# EAGLE design Mega Breakout (EAGLE 9.6.2)
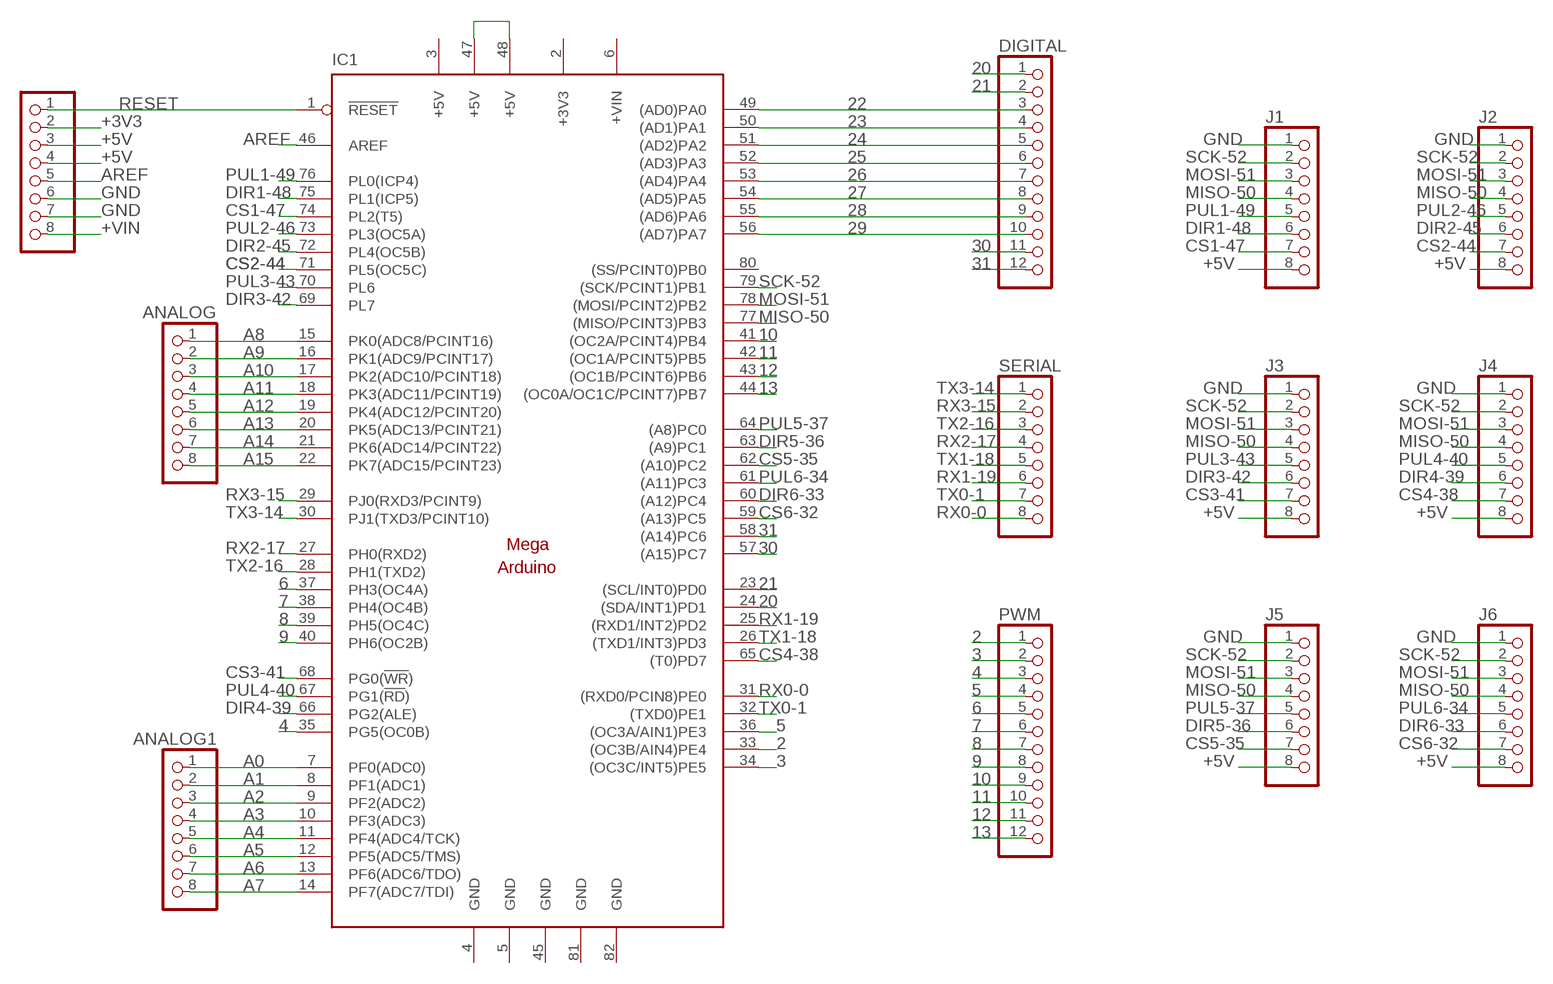
[diagram p0: schematic, sheet 1]

## Parts
ANALOG  PINHD-1X8  [1X08]
ANALOG1  PINHD-1X8  [1X08]
DIGITAL  PINHD-1X12  [1X12]
IC1  MEGAARDUINO_1  [MEGA_ARDUINO]
J1  PINHD-1X8  [1X08]
J2  PINHD-1X8  [1X08]
J3  PINHD-1X8  [1X08]
J4  PINHD-1X8  [1X08]
J5  PINHD-1X8  [1X08]
J6  PINHD-1X8  [1X08]
POWER  PINHD-1X8  [1X08]
PWM  PINHD-1X12  [1X12]
SERIAL  PINHD-1X8  [1X08]

## Nets
2: IC1.33((OC3B/AIN4)PE4) PWM.1
3: IC1.34((OC3C/INT5)PE5) PWM.2
4: IC1.35(PG5(OC0B)) PWM.3
5: IC1.36((OC3A/AIN1)PE3) PWM.4
6: IC1.37(PH3(OC4A)) PWM.5
7: IC1.38(PH4(OC4B)) PWM.6
8: IC1.39(PH5(OC4C)) PWM.7
9: IC1.40(PH6(OC2B)) PWM.8
10: IC1.41((OC2A/PCINT4)PB4) PWM.9
11: IC1.42((OC1A/PCINT5)PB5) PWM.10
12: IC1.43((OC1B/PCINT6)PB6) PWM.11
13: IC1.44((OC0A/OC1C/PCINT7)PB7) PWM.12
20: DIGITAL.1 IC1.24((SDA/INT1)PD1)
21: DIGITAL.2 IC1.23((SCL/INT0)PD0)
22: DIGITAL.3 IC1.49((AD0)PA0)
23: DIGITAL.4 IC1.50((AD1)PA1)
24: DIGITAL.5 IC1.51((AD2)PA2)
25: DIGITAL.6 IC1.52((AD3)PA3)
26: DIGITAL.7 IC1.53((AD4)PA4)
27: DIGITAL.8 IC1.54((AD5)PA5)
28: DIGITAL.9 IC1.55((AD6)PA6)
29: DIGITAL.10 IC1.56((AD7)PA7)
30: DIGITAL.11 IC1.57((A15)PC7)
31: DIGITAL.12 IC1.58((A14)PC6)
+3V3: POWER.2
+5V: J1.8 J2.8 J3.8 J4.8 J5.8 J6.8 POWER.3 POWER.4
+VIN: POWER.8
A0: ANALOG1.1 IC1.7(PF0(ADC0))
A1: ANALOG1.2 IC1.8(PF1(ADC1))
A2: ANALOG1.3 IC1.9(PF2(ADC2))
A3: ANALOG1.4 IC1.10(PF3(ADC3))
A4: ANALOG1.5 IC1.11(PF4(ADC4/TCK))
A5: ANALOG1.6 IC1.12(PF5(ADC5/TMS))
A6: ANALOG1.7 IC1.13(PF6(ADC6/TDO))
A7: ANALOG1.8 IC1.14(PF7(ADC7/TDI))
A8: ANALOG.1 IC1.15(PK0(ADC8/PCINT16))
A9: ANALOG.2 IC1.16(PK1(ADC9/PCINT17))
A10: ANALOG.3 IC1.17(PK2(ADC10/PCINT18))
A11: ANALOG.4 IC1.18(PK3(ADC11/PCINT19))
A12: ANALOG.5 IC1.19(PK4(ADC12/PCINT20))
A13: ANALOG.6 IC1.20(PK5(ADC13/PCINT21))
A14: ANALOG.7 IC1.21(PK6(ADC14/PCINT22))
A15: ANALOG.8 IC1.22(PK7(ADC15/PCINT23))
AREF: IC1.46(AREF) POWER.5
CS1-47: IC1.74(PL2(T5)) J1.7
CS2-44: IC1.71(PL5(OC5C)) J2.7
CS3-41: IC1.68(PG0(!WR!)) J3.7
CS4-38: IC1.65((T0)PD7) J4.7
CS5-35: IC1.62((A10)PC2) J5.7
CS6-32: IC1.59((A13)PC5) J6.7
DIR1-48: IC1.75(PL1(ICP5)) J1.6
DIR2-45: IC1.72(PL4(OC5B)) J2.6
DIR3-42: IC1.69(PL7) J3.6
DIR4-39: IC1.66(PG2(ALE)) J4.6
DIR5-36: IC1.63((A9)PC1) J5.6
DIR6-33: IC1.60((A12)PC4) J6.6
GND: J1.1 J2.1 J3.1 J4.1 J5.1 J6.1 POWER.6 POWER.7
MISO-50: IC1.77((MISO/PCINT3)PB3) J1.4 J2.4 J3.4 J4.4 J5.4 J6.4
MOSI-51: IC1.78((MOSI/PCINT2)PB2) J1.3 J2.3 J3.3 J4.3 J5.3 J6.3
N$1: IC1.47(+5V) IC1.48(+5V)
PUL1-49: IC1.76(PL0(ICP4)) J1.5
PUL2-46: IC1.73(PL3(OC5A)) J2.5
PUL3-43: IC1.70(PL6) J3.5
PUL4-40: IC1.67(PG1(!RD!)) J4.5
PUL5-37: IC1.64((A8)PC0) J5.5
PUL6-34: IC1.61((A11)PC3) J6.5
RESET: IC1.1(!RESET) POWER.1
RX0-0: IC1.31((RXD0/PCIN8)PE0) SERIAL.8
RX1-19: IC1.25((RXD1/INT2)PD2) SERIAL.6
RX2-17: IC1.27(PH0(RXD2)) SERIAL.4
RX3-15: IC1.29(PJ0(RXD3/PCINT9)) SERIAL.2
SCK-52: IC1.79((SCK/PCINT1)PB1) J1.2 J2.2 J3.2 J4.2 J5.2 J6.2
TX0-1: IC1.32((TXD0)PE1) SERIAL.7
TX1-18: IC1.26((TXD1/INT3)PD3) SERIAL.5
TX2-16: IC1.28(PH1(TXD2)) SERIAL.3
TX3-14: IC1.30(PJ1(TXD3/PCINT10)) SERIAL.1
Unconnected: IC1.80((SS/PCINT0)PB0)

## Power pins joined to a net without a drawn wire
+3V3: IC1.2(+3V3)
+5V: IC1.3(+5V)
+VIN: IC1.6(+VIN)
GND: IC1.4(GND) IC1.5(GND) IC1.45(GND) IC1.81(GND) IC1.82(GND)

## Library data of the parts
ANALOG ANALOG1 J1-J6 POWER SERIAL = pinhead:PINHD-1X8: PIN HEADER
DIGITAL PWM = pinhead:PINHD-1X12: PIN HEADER
IC1 = arduino:MEGAARDUINO_1: The Arduino Mega is a microcontroller board based on the ATmega1280. - 54 digital input/output pins (of which 14 can be used as PWM outputs) - 16 analog inputs - 4 UARTs (hardware serial ports) - 16 MHz crystal oscillator - USB connection - power jack - ICSP header - reset button It contains everything needed to support the microcontroller; simply connect it to a computer with a USB cable or power it with a AC-to-DC adapter or battery to get started. The Mega is compatible with most shields designed for the Arduino Duemilanove or Diecimila. http://arduino.cc/en/Main/ArduinoBoardMega

## Board
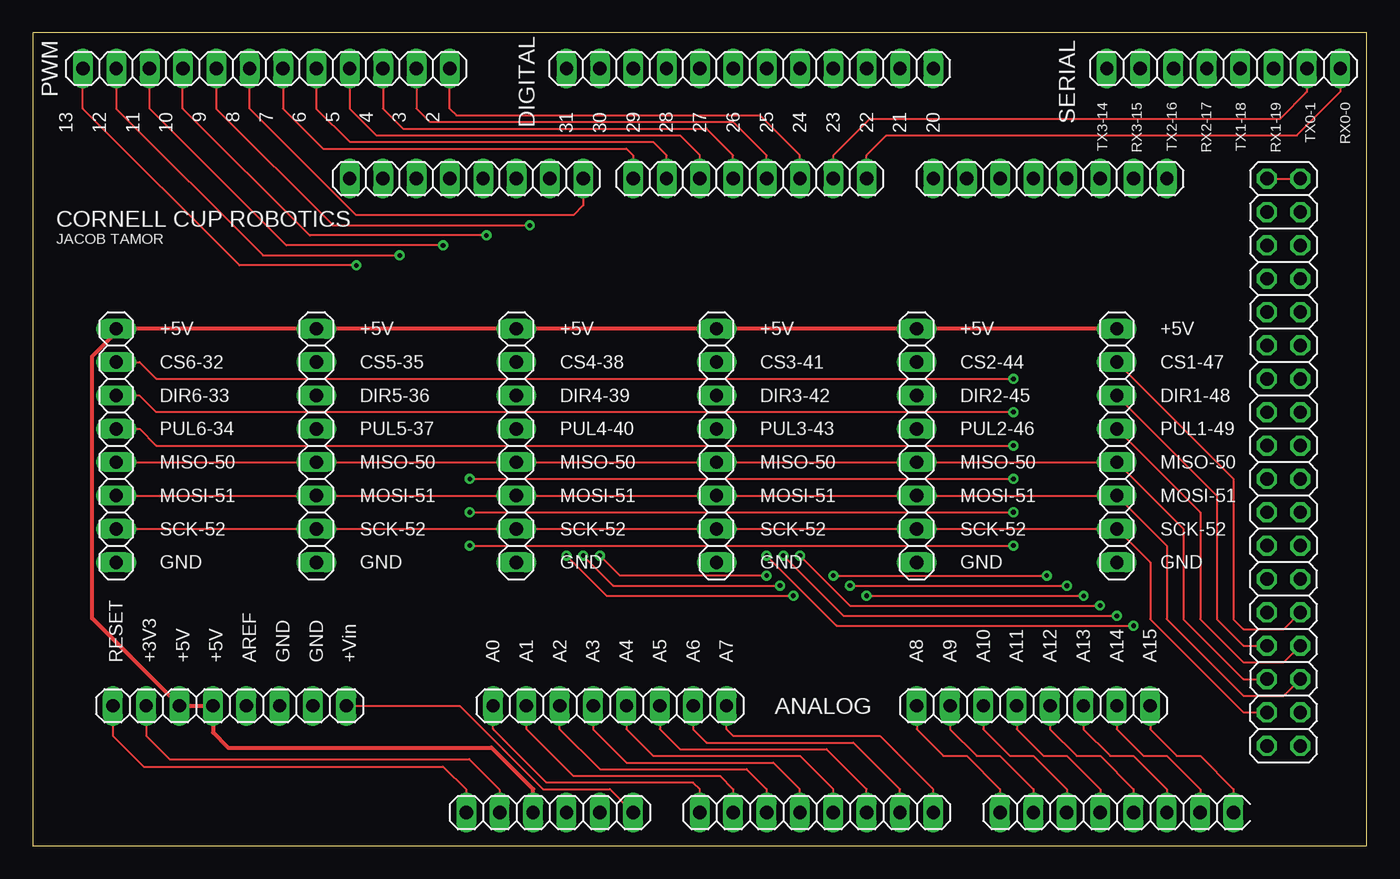
[diagram p1: board, top side]
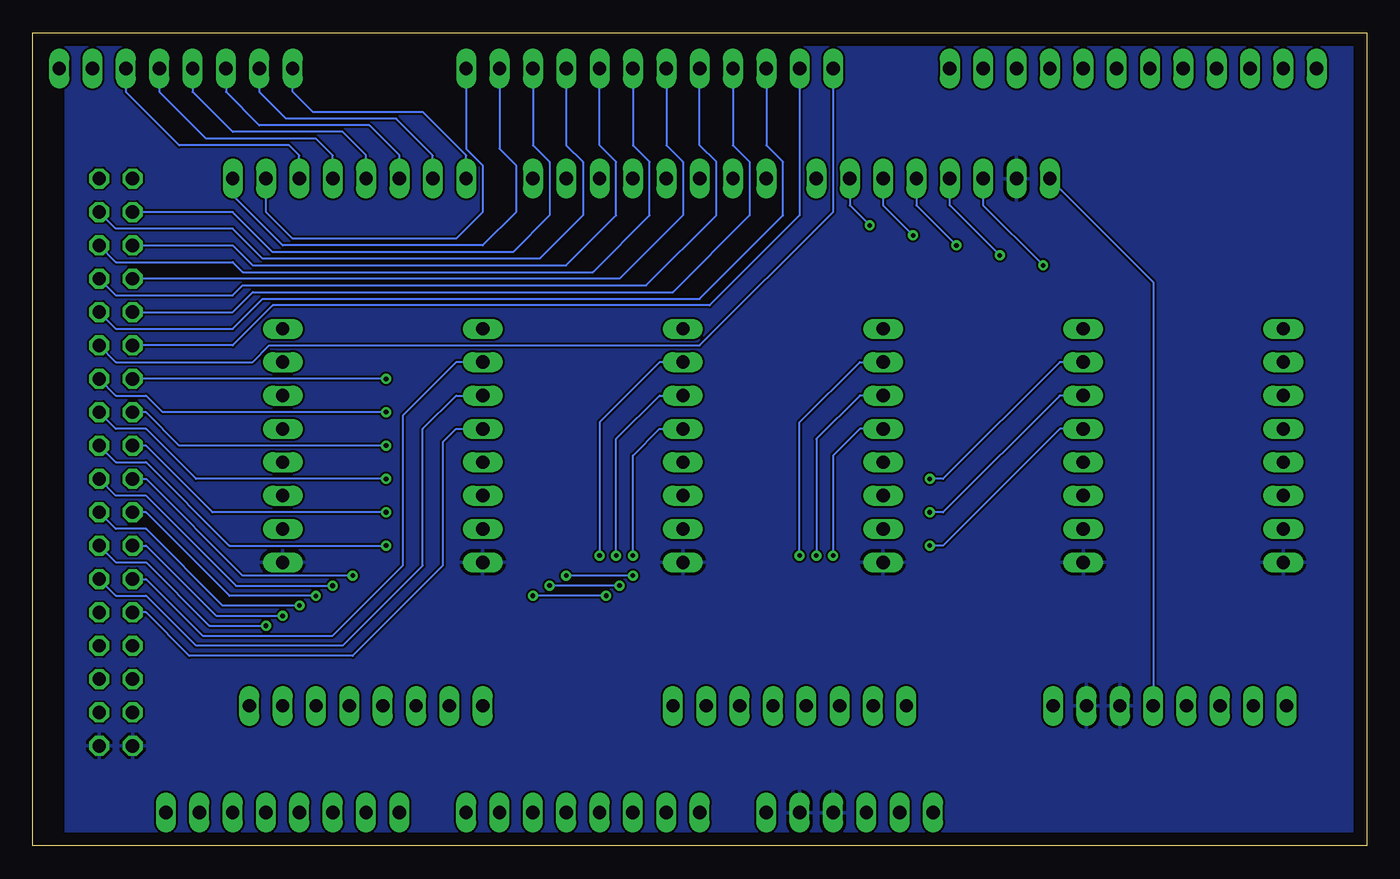
[diagram p2: board, bottom side, seen from below]

Size 101.58 x 61.9 mm. Coordinates in mm from the lower left corner, seen from the top.
Outline: 0,0 101.58,0 101.58,61.9 0,61.9 0,0
Copper layers (1*16): Top 0.035mm / dielectric 1.5mm / Bottom 0.035mm
Design rules "default": minimum track width 6mil, minimum drill 0.35mm, track to track 6mil, track to pad 6mil, pad to pad 6mil, via to via 6mil, smd to smd 6mil, copper to edge 40mil, drill to drill 6mil, minimum pad ring 10mil, minimum via ring 8mil, stop-mask expansion 4mil, vias tented up to drill 0mil, thermal gap 10mil

### Footprints (pad centres in the part's own frame; a part is rotated, then mirrored left to right if it is on the bottom)
1X08 = drill 1.016 long: 1 -8.89,0; 2 -6.35,0; 3 -3.81,0; 4 -1.27,0; 5 1.27,0; 6 3.81,0; 7 6.35,0; 8 8.89,0
1X12 = drill 1.016 long: 1 -13.97,0; 2 -11.43,0; 3 -8.89,0; 4 -6.35,0; 5 -3.81,0; 6 -1.27,0; 7 1.27,0; 8 3.81,0; 9 6.35,0; 10 8.89,0; 11 11.43,0; 12 13.97,0
MEGA_ARDUINO = drill 1.016 long: 1 33.02,2.54; 2 35.56,2.54; 3 38.1,2.54; 4 40.64,2.54; 5 43.18,2.54; 6 45.72,2.54; 7 50.8,2.54; 8 53.34,2.54; 9 55.88,2.54; 10 58.42,2.54; 11 60.96,2.54; 12 63.5,2.54; 13 66.04,2.54; 14 68.58,2.54; 15 73.66,2.54; 16 76.2,2.54; 17 78.74,2.54; 18 81.28,2.54; 19 83.82,2.54; 20 86.36,2.54; 21 88.9,2.54; 22 91.44,2.54; 23 86.36,50.8; 24 83.82,50.8; 25 81.28,50.8; 26 78.74,50.8; 27 76.2,50.8; 28 73.66,50.8; 29 71.12,50.8; 30 68.58,50.8; 31 63.5,50.8; 32 60.96,50.8; 33 58.42,50.8; 34 55.88,50.8; 35 53.34,50.8; 36 50.8,50.8; 37 48.26,50.8; 38 45.72,50.8; 39 41.91,50.8; 40 39.37,50.8; 41 36.83,50.8; 42 34.29,50.8; 43 31.75,50.8; 44 29.21,50.8; 45 26.67,50.8; 46 24.13,50.8 | drill 1.016 octagon: 47 93.98,50.8; 48 96.52,50.8; 49 93.98,48.26; 50 96.52,48.26; 51 93.98,45.72; 52 96.52,45.72; 53 93.98,43.18; 54 96.52,43.18; 55 93.98,40.64; 56 96.52,40.64; 57 93.98,38.1; 58 96.52,38.1; 59 93.98,35.56; 60 96.52,35.56; 61 93.98,33.02; 62 96.52,33.02; 63 93.98,30.48; 64 96.52,30.48; 65 93.98,27.94; 66 96.52,27.94; 67 93.98,25.4; 68 96.52,25.4; 69 93.98,22.86; 70 96.52,22.86; 71 93.98,20.32; 72 96.52,20.32; 73 93.98,17.78; 74 96.52,17.78; 75 93.98,15.24; 76 96.52,15.24; 77 93.98,12.7; 78 96.52,12.7; 79 93.98,10.16; 80 96.52,10.16; 81 93.98,7.62; 82 96.52,7.62

### Placement (x,y rotation side)
ANALOG  76.2,10.67 0 top
ANALOG1  43.94,10.67 0 top
DIGITAL  54.61,59.18 180 top
IC1  0,0 0 top
J1  82.55,30.48 90 top
J2  67.31,30.48 90 top
J3  52.07,30.48 90 top
J4  36.83,30.48 90 top
J5  21.59,30.48 90 top
J6  6.35,30.48 90 top
POWER  14.99,10.67 0 top
PWM  17.78,59.18 180 top
SERIAL  90.68,59.18 0 top

### Tracks (layer width: path | path; a pad name or v marks a point on that pad's centre or on a via)
2
  Top 0.152: PWM.1 31.75,56.13 32.26,55.63 55.37,55.63 58.42,52.58 IC1.33
3
  Top 0.152: PWM.2 29.21,56.13 30.23,55.12 53.34,55.12 55.88,52.58 IC1.34
4
  Top 0.152: PWM.3 26.67,56.13 28.19,54.61 51.31,54.61 53.34,52.58 IC1.35
5
  Top 0.152: PWM.4 24.13,56.13 26.16,54.1 49.28,54.1 50.8,52.58 IC1.36
6
  Top 0.152: PWM.5 21.59,56.13 24.13,53.59 47.24,53.59 48.26,52.58 IC1.37
7
  Top 0.152: PWM.6 19.05,56.13 22.1,53.09 45.21,53.09 45.72,52.58 IC1.38
8
  Top 0.152: IC1.39 41.91,48.77 41.17,48.03 24.61,48.03 16.51,56.13 PWM.7
9  (via drill 0.35)
  Top 0.152: PWM.8 13.97,56.13 22.86,47.24 v37.85,47.24
  Bottom 0.152: IC1.40 39.37,48.77 v37.85,47.24
10  (via drill 0.35)
  Top 0.152: v34.54,46.48 21.08,46.48 11.43,56.13 PWM.9
  Bottom 0.152: IC1.41 36.83,48.77 v34.54,46.48
11  (via drill 0.35)
  Top 0.152: v31.24,45.72 19.3,45.72 8.89,56.13 PWM.10
  Bottom 0.152: IC1.42 34.29,48.77 v31.24,45.72
12  (via drill 0.35)
  Top 0.152: PWM.11 6.35,56.13 17.53,44.96 v27.94,44.96
  Bottom 0.152: IC1.43 31.75,48.77 v27.94,44.96
13  (via drill 0.35)
  Top 0.152: v24.64,44.2 15.75,44.2 3.81,56.13 PWM.12
  Bottom 0.152: IC1.44 29.21,48.77 v24.64,44.2
20
  Bottom 0.152: DIGITAL.1 68.58,53.09 67.31,51.82 67.31,48.26 69.34,46.23 81.79,46.23 83.82,48.26 IC1.24
21
  Bottom 0.152: DIGITAL.2 66.04,53.09 64.77,51.82 64.77,48.26 67.31,45.72 82.55,45.72 86.36,49.53 IC1.23
22
  Bottom 0.152: DIGITAL.3 63.5,53.34 62.23,52.07 62.23,48.01 65.02,45.21 83.31,45.21 86.36,48.26 IC1.49
23
  Bottom 0.152: DIGITAL.4 60.96,53.34 59.69,52.07 59.69,48.01 62.99,44.7 84.07,44.7 86.36,46.99 95.25,46.99 IC1.50
24
  Bottom 0.152: IC1.51 86.36,45.72 84.84,44.2 60.96,44.2 57.15,48.01 57.15,52.07 58.42,53.34 DIGITAL.5
25
  Bottom 0.152: DIGITAL.6 55.88,53.34 54.61,52.07 54.61,48.01 58.93,43.69 85.6,43.69 86.36,44.45 95.25,44.45 IC1.52
26
  Bottom 0.152: DIGITAL.7 53.34,53.34 52.07,52.07 52.07,48.01 56.9,43.18 IC1.53
27
  Bottom 0.152: IC1.54 95.25,41.91 86.36,41.91 85.6,42.67 54.86,42.67 49.53,48.01 49.53,52.07 50.8,53.34 DIGITAL.8
28
  Bottom 0.152: IC1.55 86.36,40.64 84.84,42.16 52.83,42.16 46.99,48.01 46.99,52.07 48.26,53.34 DIGITAL.9
29
  Bottom 0.152: DIGITAL.10 45.72,53.34 44.45,52.07 44.45,48.01 50.8,41.66 84.07,41.66 86.36,39.37 95.25,39.37 IC1.56
30
  Bottom 0.152: IC1.57 86.36,38.1 83.31,41.15 50.04,41.15 43.18,48.01 DIGITAL.11
31
  Bottom 0.152: IC1.58 95.25,36.83 84.84,36.83 83.57,38.1 50.8,38.1 40.64,48.26 DIGITAL.12
+3V3
  Top 0.152: POWER.2 8.64,8.38 10.41,6.6 33.23,6.6 35.56,4.27 IC1.2
+5V
  Top 0.305: J1.8 J2.8 J3.8 J4.8 J5.8 J6.8 6.35,39.1 4.52,37.27 4.52,17.32 POWER.3 POWER.4 13.72,8.64 14.86,7.49 34.92,7.49 38.1,4.32 IC1.3
+VIN
  Top 0.152: POWER.8 32.51,10.67 38.86,4.32 43.94,4.32 IC1.6
A0
  Top 0.152: ANALOG1.1 35.05,8.89 39.12,4.83 50.29,4.83 50.8,4.32 IC1.7
A1
  Top 0.152: ANALOG1.2 37.59,8.89 41.15,5.33 52.32,5.33 53.34,4.32 IC1.8
A2
  Top 0.152: ANALOG1.3 40.13,8.89 43.18,5.84 54.36,5.84 55.88,4.32 IC1.9
A3
  Top 0.152: ANALOG1.4 42.67,8.89 45.21,6.35 56.39,6.35 58.42,4.32 IC1.10
A4
  Top 0.152: ANALOG1.5 45.21,8.89 47.24,6.86 58.42,6.86 60.96,4.32 IC1.11
A5
  Top 0.152: ANALOG1.6 47.75,8.89 49.28,7.37 60.45,7.37 63.5,4.32 IC1.12
A6
  Top 0.152: ANALOG1.7 50.29,8.89 51.31,7.87 62.48,7.87 66.04,4.32 IC1.13
A7
  Top 0.152: ANALOG1.8 52.83,8.89 53.34,8.38 64.52,8.38 68.58,4.32 IC1.14
A8
  Top 0.152: ANALOG.1 67.31,8.89 69.34,6.86 71.12,6.86 73.66,4.32 IC1.15
A9
  Top 0.152: ANALOG.2 69.85,8.89 71.88,6.86 73.66,6.86 76.2,4.32 IC1.16
A10
  Top 0.152: ANALOG.3 72.39,8.89 74.42,6.86 76.2,6.86 78.74,4.32 IC1.17
A11
  Top 0.152: ANALOG.4 74.93,8.89 76.96,6.86 78.74,6.86 81.28,4.32 IC1.18
A12
  Top 0.152: ANALOG.5 77.47,8.89 79.5,6.86 81.28,6.86 83.82,4.32 IC1.19
A13
  Top 0.152: ANALOG.6 80.01,8.89 82.04,6.86 83.82,6.86 86.36,4.32 IC1.20
A14
  Top 0.152: ANALOG.7 82.55,8.89 84.58,6.86 86.36,6.86 88.9,4.32 IC1.21
A15
  Top 0.152: ANALOG.8 85.09,8.89 87.12,6.86 88.9,6.86 91.44,4.32 IC1.22
AREF
  Bottom 0.152: IC1.46 16.26,42.93 POWER.5
CS1-47
  Top 0.152: J1.7 91.44,27.94 91.44,17.27 92.2,16.51 95.25,16.51 IC1.74
CS2-44
  Bottom 0.152: IC1.71 92.96,20.32 88.65,16 78.74,16 73.41,21.34 73.41,32.77 69.34,36.83 J2.7
CS3-41  (via drill 0.35)
  Top 0.152: v58.42,22.1 62.21,18.3 v81.27,18.3
  Bottom 0.152: J3.7 53.85,36.83 58.42,32.26 v58.42,22.1 | v81.27,18.3 87.14,18.3 92.96,24.13 95.25,24.13 IC1.68
CS4-38  (via drill 0.35)
  Top 0.152: v55.88,20.57 44.7,20.57 v43.18,22.1 | v60.96,20.57 v77.22,20.57
  Bottom 0.152: IC1.65 92.96,27.94 85.6,20.57 v77.22,20.57 | v43.18,22.1 43.18,32.26 38.61,36.83 J4.7 | v55.88,20.57 v60.96,20.57
CS5-35  (via drill 0.35)
  Top 0.152: v33.27,27.94 v74.68,27.94
  Bottom 0.152: J5.7 23.37,36.83 32.26,27.94 v33.27,27.94 | v74.68,27.94 89.15,27.94 92.96,31.75 95.25,31.75 IC1.62
CS6-32  (via drill 0.35)
  Top 0.152: J6.7 8.13,36.83 9.4,35.56 v74.68,35.56
  Bottom 0.152: v74.68,35.56 IC1.59
DIR1-48
  Top 0.152: J1.6 90.17,26.67 90.17,17.27 92.2,15.24 IC1.75
DIR2-45
  Bottom 0.152: J2.6 69.34,34.29 71.88,31.75 71.88,21.34 77.98,15.24 89.15,15.24 92.96,19.05 95.25,19.05 IC1.72
DIR3-42  (via drill 0.35)
  Top 0.152: v57.15,22.1 61.71,17.53 v82.56,17.52
  Bottom 0.152: IC1.69 92.96,22.86 87.63,17.53 v82.56,17.52 | v57.15,22.1 57.15,30.99 53.85,34.29 J3.6
DIR4-39  (via drill 0.35)
  Top 0.152: v41.91,22.1 44.2,19.81 v56.9,19.81 | v62.23,19.81 78.74,19.81 v78.75,19.8
  Bottom 0.152: J4.6 38.61,34.29 41.91,30.99 v41.91,22.1 | IC1.66 95.25,26.67 92.96,26.67 86.1,19.8 v78.75,19.8 | v56.9,19.81 v62.23,19.81
DIR5-36  (via drill 0.35)
  Top 0.152: v33.27,25.4 v74.68,25.4
  Bottom 0.152: J5.6 23.37,34.29 32.26,25.4 v33.27,25.4 | v74.68,25.4 87.88,25.4 92.96,30.48 IC1.63
DIR6-33  (via drill 0.35)
  Top 0.152: v74.68,33.02 9.4,33.02 8.13,34.29 J6.6
  Bottom 0.152: v74.68,33.02 74.7,33.05 91.72,33.05 92.96,34.29 95.25,34.29 IC1.60
GND
  pour Bottom: 0.76,61.72 0.76,0 99.06,0 99.06,61.72
MISO-50
  Top 0.152: IC1.77 92.2,12.7 87.63,17.27 87.63,24.13 J1.4 J2.4 J3.4 J4.4 J5.4 J6.4
MOSI-51
  Top 0.152: IC1.78 95.25,11.43 92.2,11.43 86.36,17.27 86.36,22.86 J1.3 J2.3 J3.3 J4.3 J5.3 J6.3
N$1
  Top 0.152: IC1.47 IC1.48
PUL1-49
  Top 0.152: J1.5 88.9,25.4 88.9,17.27 92.2,13.97 95.25,13.97 IC1.76
PUL2-46
  Bottom 0.152: J2.5 69.34,31.75 70.36,30.73 70.36,21.34 77.22,14.48 89.66,14.48 92.96,17.78 IC1.73
PUL3-43  (via drill 0.35)
  Top 0.152: v55.88,22.1 61.21,16.76 v83.82,16.76
  Bottom 0.152: IC1.70 95.25,21.59 92.96,21.59 88.14,16.76 v83.82,16.76 | v55.88,22.1 55.88,29.72 53.85,31.75 J3.5
PUL4-40  (via drill 0.35)
  Top 0.152: v40.64,22.1 43.69,19.05 v57.91,19.05 | v80.03,19.04 80.01,19.05 v63.5,19.05
  Bottom 0.152: J4.5 38.61,31.75 40.64,29.72 v40.64,22.1 | v57.91,19.05 v63.5,19.05 | v80.03,19.04 86.6,19.04 92.96,25.4 IC1.67
PUL5-37  (via drill 0.35)
  Top 0.152: v33.27,22.86 v74.68,22.86
  Bottom 0.152: IC1.64 95.25,29.21 92.96,29.21 86.61,22.86 v74.68,22.86 | J5.5 23.37,31.75 32.26,22.86 v33.27,22.86
PUL6-34  (via drill 0.35)
  Top 0.152: J6.5 8.13,31.75 9.4,30.48 v74.68,30.48
  Bottom 0.152: v74.68,30.48 90.42,30.48 92.96,33.02 IC1.61
RESET
  Top 0.152: IC1.1 33.02,4.27 31.24,6.04 8.43,6.04 6.1,8.38 POWER.1
RX0-0
  Top 0.152: IC1.31 63.5,52.58 65.02,54.1 96.27,54.1 99.57,57.4 SERIAL.8
RX1-19
  Bottom 0.152: IC1.25 81.28,52.58 82.04,53.34 90.42,53.34 94.49,57.4 SERIAL.6
RX2-17
  Bottom 0.152: IC1.27 76.2,52.58 77.98,54.36 86.36,54.36 89.41,57.4 SERIAL.4
RX3-15
  Bottom 0.152: SERIAL.2 84.33,57.4 82.3,55.37 73.91,55.37 71.12,52.58 IC1.29
SCK-52
  Top 0.152: IC1.79 92.2,10.16 85.09,17.27 85.09,21.59 J1.2 J2.2 J3.2 J4.2 J5.2 J6.2
TX0-1
  Top 0.152: IC1.32 60.96,52.58 63.75,55.37 95,55.37 97.03,57.4 SERIAL.7
TX1-18
  Bottom 0.152: IC1.26 78.74,52.58 80.01,53.85 88.39,53.85 91.95,57.4 SERIAL.5
TX2-16
  Bottom 0.152: IC1.28 73.66,52.58 75.95,54.86 84.33,54.86 86.87,57.4 SERIAL.3
TX3-14
  Bottom 0.152: IC1.30 68.58,52.58 71.88,55.88 80.26,55.88 81.79,57.4 SERIAL.1

### Text on the board
tPlace: PWM | DIGITAL | SERIAL | TX3-14 / RX3-15 / TX2-16 / RX2-17 / TX1-18 / RX1-19 / TX0-1 / RX0-0 | 13 / 12 / 11 / 10 / 9 / 8 / 7 / 6 / 5 / 4 / 3 / 2 | 31 / 30 / 29 / 28 / 27 / 26 / 25 / 24 / 23 / 22 / 21 / 20 | CORNELL CUP ROBOTICS | JACOB TAMOR | +5V / CS6-32 / DIR6-33 / PUL6-34 / MISO-50 / MOSI-51 / SCK-52 / GND | +5V / CS5-35 / DIR5-36 / PUL5-37 / MISO-50 / MOSI-51 / SCK-52 / GND | +5V / CS4-38 / DIR4-39 / PUL4-40 / MISO-50 / MOSI-51 / SCK-52 / GND | +5V / CS3-41 / DIR3-42 / PUL3-43 / MISO-50 / MOSI-51 / SCK-52 / GND | +5V / CS2-44 / DIR2-45 / PUL2-46 / MISO-50 / MOSI-51 / SCK-52 / GND | +5V / CS1-47 / DIR1-48 / PUL1-49 / MISO-50 / MOSI-51 / SCK-52 / GND | RESET / +3V3 / +5V / +5V / AREF / GND / GND / +Vin | A0 / A1 / A2 / A3 / A4 / A5 / A6 / A7 | A8 / A9 / A10 / A11 / A12 / A13 / A14 / A15 | ANALOG